# Altium schematic sheet UWB_F3_CAN_UWB_layout.SchDoc
size A4; DrawnBy: Philip Rowse
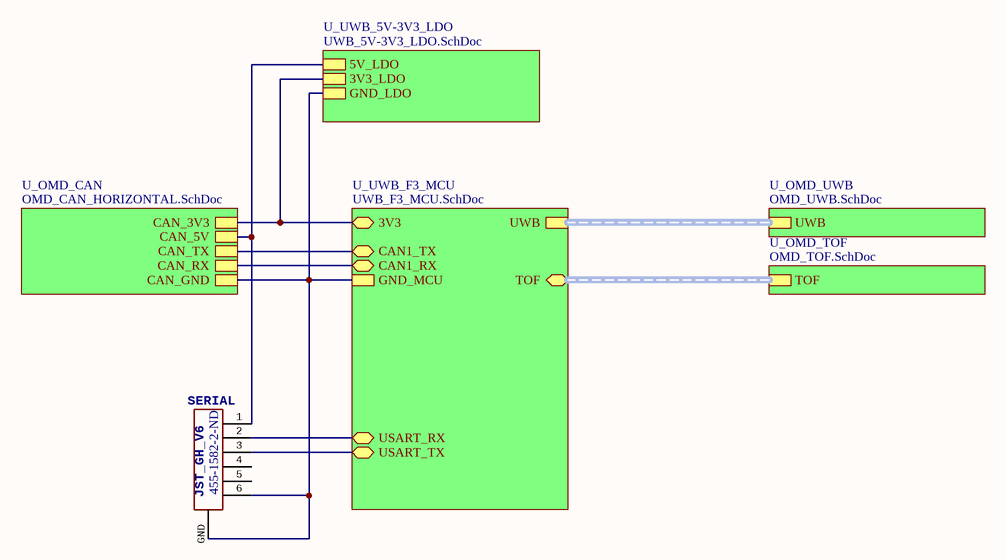
[diagram p0: UWB_F3_CAN_UWB_layout.SchDoc]

## Parts
SERIAL  JST_GH_V6  Supplier Part Number 1: 455-1582-2-ND  [JST_GH_V6]

## Sub-sheets
U_OMD_CAN = OMD_CAN_HORIZONTAL.SchDoc: CAN_RX, CAN_TX, CAN_5V, CAN_GND, CAN_3V3
U_OMD_TOF = OMD_TOF.SchDoc: TOF (harness TOF)
U_OMD_UWB = OMD_UWB.SchDoc: UWB (harness UWB)
U_UWB_5V-3V3_LDO = UWB_5V-3V3_LDO.SchDoc: 5V_LDO, 3V3_LDO, GND_LDO
U_UWB_F3_MCU = UWB_F3_MCU.SchDoc: GND_MCU, UWB (harness UWB), 3V3, CAN1_TX, CAN1_RX, TOF (harness TOF), USART_RX, USART_TX

## Nets
NetSERIAL_1: SERIAL.1 ; sheet U_OMD_CAN/CAN_5V, sheet U_UWB_5V-3V3_LDO/5V_LDO
NetSERIAL_2: SERIAL.2 ; sheet U_UWB_F3_MCU/USART_RX
NetSERIAL_3: SERIAL.3 ; sheet U_UWB_F3_MCU/USART_TX
NetSERIAL_6: SERIAL.6 SERIAL.GND ; sheet U_UWB_F3_MCU/GND_MCU, sheet U_OMD_CAN/CAN_GND, sheet U_UWB_5V-3V3_LDO/GND_LDO
(unnamed): sheet U_UWB_F3_MCU/3V3, sheet U_OMD_CAN/CAN_3V3, sheet U_UWB_5V-3V3_LDO/3V3_LDO
(unnamed): sheet U_UWB_F3_MCU/CAN1_TX, sheet U_OMD_CAN/CAN_TX
(unnamed): sheet U_UWB_F3_MCU/CAN1_RX, sheet U_OMD_CAN/CAN_RX

Not connected (* = marked no-connect by the designer): SERIAL 4 5

## Buses and harness runs
harness sheet U_OMD_TOF/TOF = sheet U_UWB_F3_MCU/TOF
harness sheet U_OMD_UWB/UWB = sheet U_UWB_F3_MCU/UWB

## Notes on the sheet
- Title
- Size:
- Date:
- A4
- Number:
- Time:
- Revision:
- Sheet
- of
- File:

## Library data of the parts
SERIAL = JST_GH_V6: BM06B-GHS-TBT; Supplier 1: Digi-Key